# Altium project inter.PrjPcb
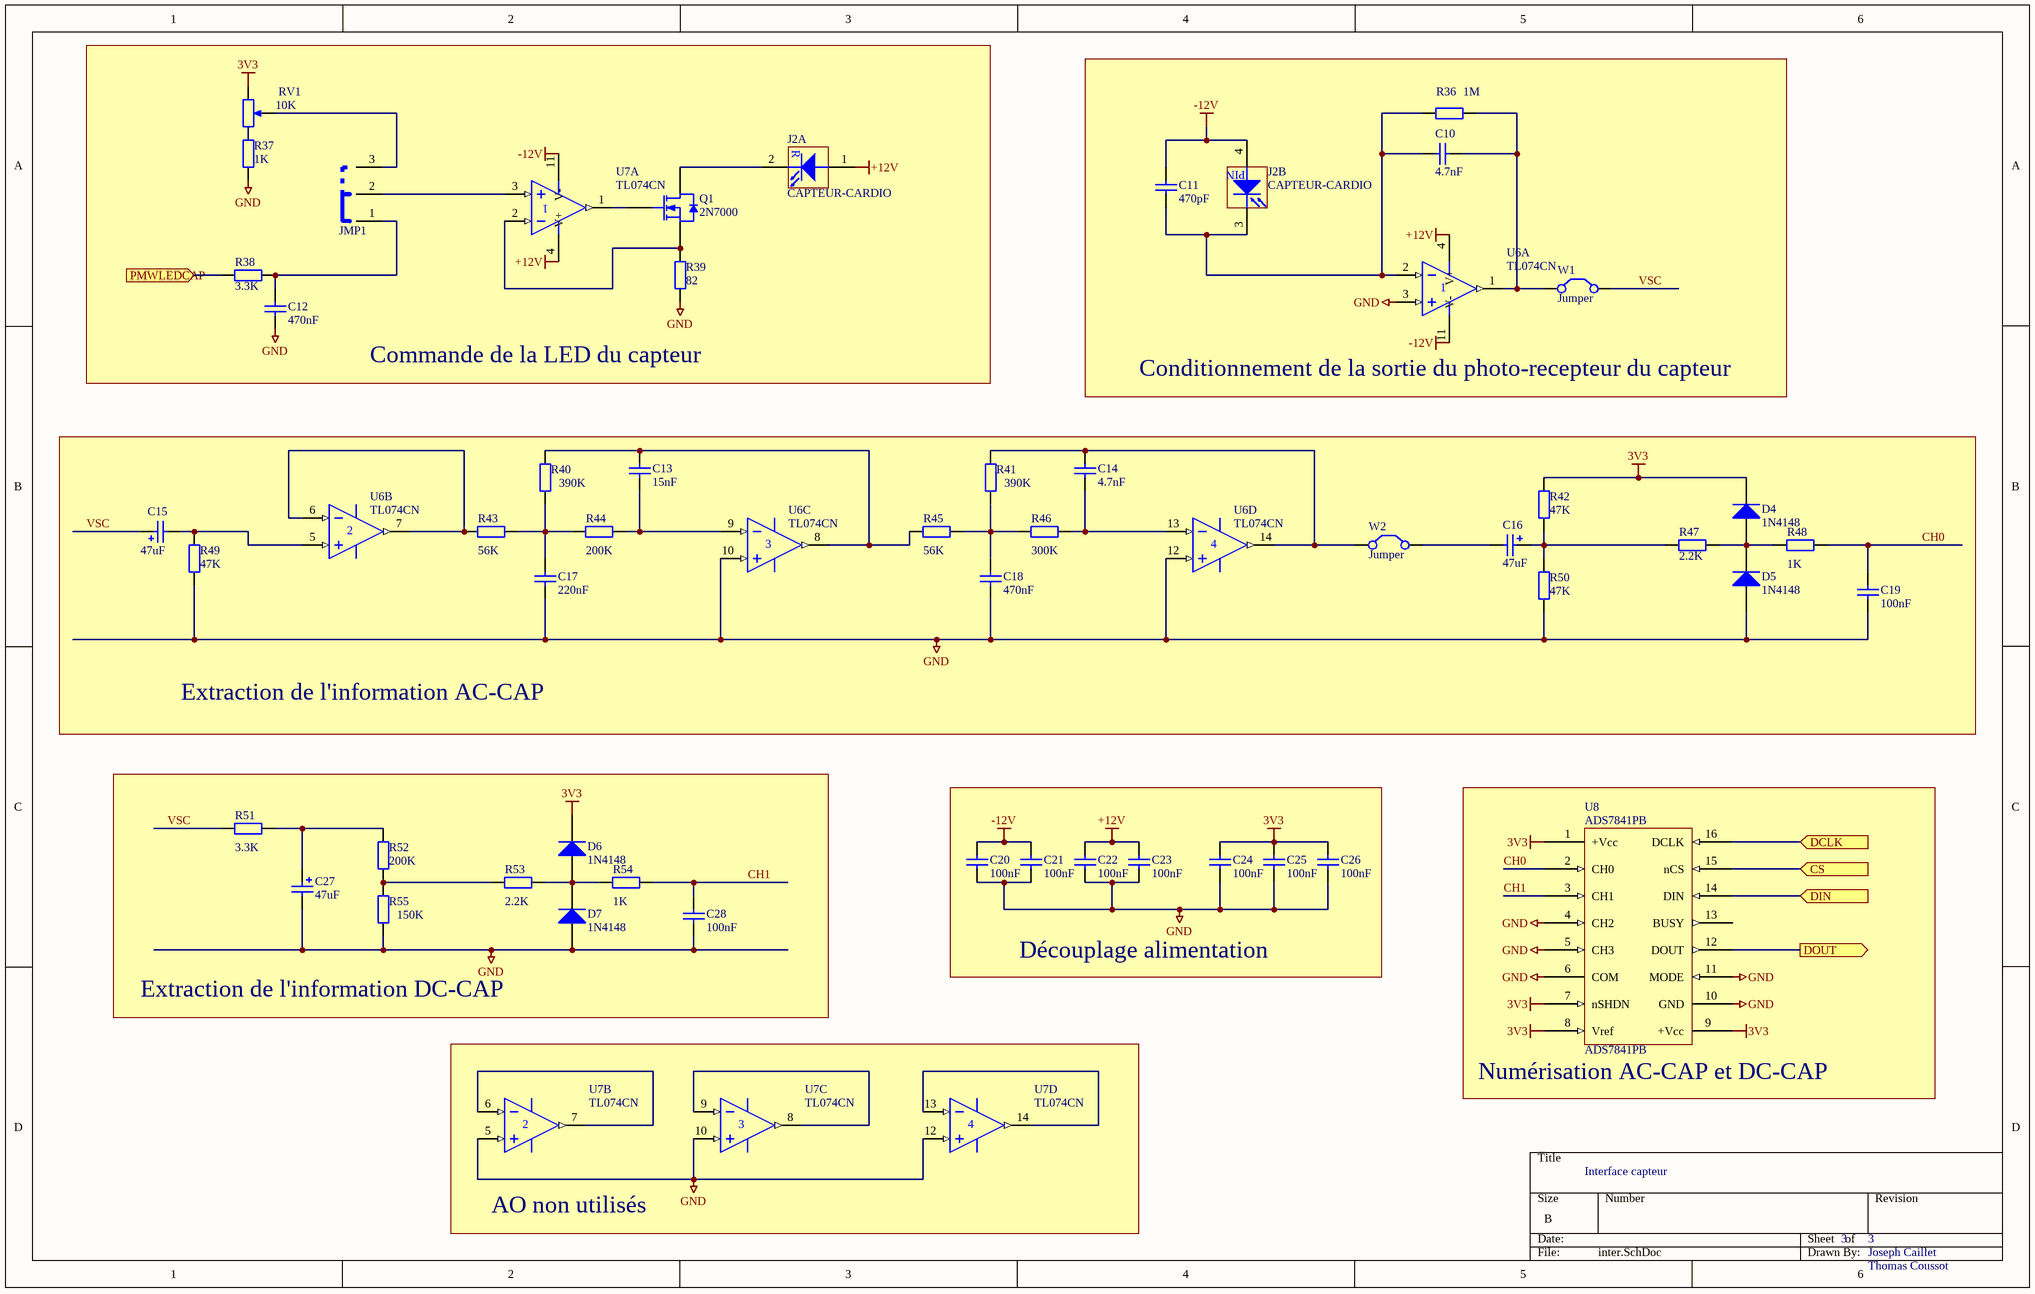
[diagram p0: inter.SchDoc]
1 sheet, 52 parts. Net scope: flat (ports and power ports of the same name join across sheets).

## Sheet inter.SchDoc
size B

### Parts
C10  4.7nF  [rad-0.2-bot]
C11  470pF  [rad-0.2-bot]
C12  470nF  [rad-0.2-bot]
C13  15nF  [rad-0.2-bot]
C14  4.7nF  [rad-0.2-bot]
C15  47uF  [RAD-0.2-BOT]
C16  47uF  [RAD-0.2-BOT]
C17  220nF  [rad-0.2-bot]
C18  470nF  [rad-0.2-bot]
C19  100nF  [rad-0.2]
C20  100nF  [rad-0.2]
C21  100nF  [rad-0.2]
C22  100nF  [rad-0.2]
C23  100nF  [rad-0.2]
C24  100nF  [rad-0.2]
C25  100nF  [rad-0.2]
C26  100nF  [rad-0.2]
C27  47uF  [RAD-0.2-BOT]
C28  100nF  [rad-0.2]
D4  1N4148  [diode-0.4]
D5  1N4148  [diode-0.4]
D6  1N4148  [diode-0.4]
D7  1N4148  [diode-0.4]
J2  CAPTEUR-CARDIO  [KK-1X4M]  (parts A,B of 2)
JMP1  JUMPER-INV  [JMP3-INV-0.1]  (value not drawn)
Q1  2N7000  [NMOS-TO92]
R36  1M  [axial-0.4]
R37  1K  [axial-0.4]
R38  3.3K  [axial-0.4]
R39  82  [axial-0.4]
R40  390K  [axial-0.4]
R41  390K  [axial-0.4]
R42  47K  [axial-0.4]
R43  56K  [axial-0.4]
R44  200K  [axial-0.4]
R45  56K  [axial-0.4]
R46  300K  [axial-0.4]
R47  2.2K  [axial-0.4]
R48  1K  [axial-0.4]
R49  47K  [axial-0.4]
R50  47K  [axial-0.4]
R51  3.3K  [axial-0.4]
R52  200K  [axial-0.4]
R53  2.2K  [axial-0.4]
R54  1K  [axial-0.4]
R55  150K  [axial-0.4]
RV1  10K  [VR-3386F-T]
U6  TL074CN  [dip-14]  (parts A,B,C,D of 4)
U7  TL074CN  [dip-14]  (parts A,B,C,D of 4)
U8  ADS7841PB  [DIP-16]
W1  Jumper  [JMP2-0.1]
W2  Jumper  [JMP2-0.1]

### Blocks framed on the sheet
Commande de la LED du capteur: C12 J2 JMP1 Q1 R37-R39 RV1 U7
Conditionnement de la sortie du photo-recepteur du capteur: C10 C11 J2 R36 U6 W1
Extraction de l'information AC-CAP: C13-C19 D4 D5 R40-R50 U6 W2
Extraction de l'information DC-CAP: C27 C28 D6 D7 R51-R55
Découplage alimentation: C20-C26
Numérisation AC-CAP et DC-CAP: U8
AO non utilisés: U7

### Ports
CS (in), DCLK (in), DIN (in), DOUT (out), PMWLEDCAP (in)

### Nets
3V3: C24.2 C25.2 C26.2 D4.2(K) D6.2(K) R42.2 RV1.2(BOT) U8.1(+Vcc) U8.7(nSHDN) U8.8(Vref) U8.9(+Vcc)
+12V: C22.2 C23.2 J2.1(A-R) U6.4(V+) U7.4(V+)
-12V: C11.2 C20.2 C21.2 J2.4(A-DET) U6.11(V-) U7.11(V-)
GND: C12.1 C17.2 C18.2 C19.1 C20.1 C21.1 C22.1 C23.1 C24.1 C25.1 C26.1 C27.2 C28.1 D5.1(A) D7.1(A) R37.1 R39.2 R49.1 R50.1 R55.2 U6.3(IN+) U6.10(IN+) U6.12(IN+) U7.5(IN+) U7.10(IN+) U7.12(IN+) U8.4(CH2) U8.5(CH3) U8.6(COM) U8.10(GND) U8.11(MODE)
CH0: C19.2 R48.1 U8.2(CH0)
CH1: C28.2 R54.1 U8.3(CH1)
VSC: C15.1 R51.2 W1.2(C2)
NetC10_1: C10.1 R36.2 U6.1(OUT) W1.1(C1)
NetC10_2: C10.2 C11.1 J2.3(K-DET) R36.1 U6.2(IN-)
NetC12_2: C12.2 JMP1.1 R38.2
NetC13_1: C13.1 R40.2 R45.2 U6.8(OUT)
NetC13_2: C13.2 R44.2 U6.9(IN-)
NetC14_1: C14.1 R41.2 U6.14(OUT) W2.1(C1)
NetC14_2: C14.2 R46.2 U6.13(IN-)
NetC15_2: C15.2 R49.2 U6.5(IN+)
NetC16_1: C16.1 R42.1 R47.2 R50.2
NetC16_2: C16.2 W2.2(C2)
NetC17_1: C17.1 R40.1 R43.1 R44.1
NetC18_1: C18.1 R41.1 R45.1 R46.1
NetC27_1: C27.1 R51.1 R52.1
NetD4_1: D4.1(A) D5.2(K) R47.1 R48.2
NetD6_1: D6.1(A) D7.2(K) R53.1 R54.2
NetJ2_2: J2.2(K-R) Q1.1(D)
NetJMP1_2: JMP1.2 U7.3(IN+)
NetJMP1_3: JMP1.3 RV1.3(TAP)
NetQ1_2: Q1.2(G) U7.1(OUT)
NetQ1_3: Q1.3(S) R39.1 U7.2(IN-)
NetR37_2: R37.2 RV1.1(TOP)
NetR38_1: R38.1 ; port PMWLEDCAP
NetR43_2: R43.2 U6.6(IN-) U6.7(OUT)
NetR52_2: R52.2 R53.2 R55.1
NetU7_6: U7.6(IN-) U7.7(OUT)
NetU7_8: U7.8(OUT) U7.9(IN-)
NetU7_13: U7.13(IN-) U7.14(OUT)
NetU8_12: U8.12(DOUT) ; port DOUT
NetU8_14: U8.14(DIN) ; port DIN
NetU8_15: U8.15(nCS) ; port CS
NetU8_16: U8.16(DCLK) ; port DCLK

Not connected (* = marked no-connect by the designer): U8 13(BUSY)

### Notes on the sheet
- Interface capteur
- 3
- Joseph Caillet
- Thomas Coussot
- (in symbol CAPTEUR-CARDIO, part A) R
- (in symbol CAPTEUR-CARDIO, part B) PIN

### Library data of the parts
C10-C14 C17 C18 = Cap: Capacitor Polyester 5%; Published: 8-Jun-2000; LatestRevisionDate: 17-Jul-2002; LatestRevisionNote: Re-released for DXP Platform.; PackageReference: RAD-0.3; Publisher: Altium Limited; PackageDescription: Radial Cap, Thru-Hole; 2 Leads; 0.3 in Pin Spacing
  C10 C14: Value: 4.7nF
  C11: Value: 470pF
  C12 C18: Value: 470nF
  C13: Value: 15nF
  C17: Value: 220nF
C15 C16 C27 = Cap Pol1: Polarized Capacitor (Axial); Published: 8-Jun-2000; LatestRevisionDate: 17-Jul-2002; LatestRevisionNote: Re-released for DXP Platform.; PackageReference: RB7.6-15; Publisher: Altium Limited; PackageDescription: Polarized Capacitor (Radial); 2 Leads; Value: 47uF
C19-C26 C28 = Cap: Capacitor Céramique Multicouche X7R 50V RadialPas=5.08mm 50%; Published: 8-Jun-2000; LatestRevisionDate: 17-Jul-2002; LatestRevisionNote: Re-released for DXP Platform.; PackageReference: RAD-0.3; Publisher: Altium Limited; PackageDescription: Radial Cap, Thru-Hole; 2 Leads; 0.3 in Pin Spacing; Value: 100nF
D4-D7 = 1N4148: High Conductance Fast Diode; Published: 8-Jun-2000; LatestRevisionDate: 17-Jul-2002; LatestRevisionNote: Re-released for DXP Platform.; DatasheetDocument: 1997; PackageReference: DO-35; Publisher: Altium Limited; Code_JEDEC: DO-204-AH; ComponentLink1Description: Manufacturer Link; ComponentLink1URL: http://www.fairchildsemi.com/; ComponentLink2Description: Datasheet; ComponentLink2URL: http://www.fairchildsemi.com/ds/1N%2F1N4148.pdf
J2 = CAPTEUR-CARDIO: CAPTEUR CARDIO
JMP1 = JUMPER-INV: JUMPER INVERSEUR HE14 MALE 3 cts
Q1 = 2N7000: N-channel Enhancement Mode Field-effect Transistor; Published: 17-Sep-2003; LatestRevisionDate: 12-Dec-2006; LatestRevisionNote: Footprint pad sequence fixed.; DatasheetVersion: 19-May-2000; PackageVersion: Feb-1997; PackageReference: SOT54; Publisher: Altium Limited; PackageDescription: Plastic Single-Ended Leaded (through hole) package; 3 Leads (TO-92); Code_JEITA: SC-43; Code_JEDEC: TO-92; ComponentLink1Description: Manufacturer Link; ComponentLink1URL: http://www.semiconductors.philips.com/; ComponentLink2Description: Datasheet; ComponentLink2URL: http://www.semiconductors.philips.com/acrobat/datasheets/2N7000-03.pdf
R36 R40-R47 R49-R51 = Res2: Resistor 1% Couche métallique 0.4W Axial L=7mm; Published: 8-Jun-2000; LatestRevisionDate: 17-Jul-2002; LatestRevisionNote: Re-released for DXP Platform.; PackageReference: AXIAL-0.4; Publisher: Altium Limited; PackageDescription: Axial Device, Thru-Hole; 2 Leads; 0.4 in Pin Spacing
  R36: Value: 1M
  R40 R41: Value: 390K
  R42 R49 R50: Value: 47K
  R43 R45: Value: 56K
  R44: Value: 200K
  R46: Value: 300K
  R47: Value: 2.2K
  R51: Value: 3.3K
R37-R39 R48 R52-R55 = Res2: Resistor 5% Couche métallique 0.4W Axial L=7mm; Published: 8-Jun-2000; LatestRevisionDate: 17-Jul-2002; LatestRevisionNote: Re-released for DXP Platform.; PackageReference: AXIAL-0.4; Publisher: Altium Limited; PackageDescription: Axial Device, Thru-Hole; 2 Leads; 0.4 in Pin Spacing
  R37 R48 R54: Value: 1K
  R38: Value: 3.3K
  R39: Value: 82
  R52: Value: 200K
  R53: Value: 2.2K
  R55: Value: 150K
RV1 = R-TRIM: TRIMMER PRECISION POTENTIOMETER; Manufacturer: Bourns/Vishay; Class I: Passive; Set Position: 0.5; Class II: Potentiometer; Value: 10K
U6 U7 = TL074CN: Low-Noise JFET-Input Operational Amplifier; Manufacturer: Texas/Motorola; Published: 17-Jul-2002; LatestRevisionDate: 06-Jun-2005; LatestRevisionNote: Stylized 3D Model Added.; DatasheetVersion: 1988; PackageVersion: 1997; PackageReference: 646-06; Publisher: Altium Limited; PackageDescription: DIP; 14 Leads; Row Spacing 7.62 mm; Pitch 2.54 mm; ComponentLink1Description: Manufacturer Link; ComponentLink1URL: http://www.onsemi.com/site/products/parametrics/0,4446,251,00.html
U8 = ADS7841PB: Analog to Digital converter; Manufacturer: TEXAS
W1 W2 = Jumper: Jumper Wire; Published: 24-Mar-1999; LatestRevisionDate: 17-Jul-2002; LatestRevisionNote: Re-released for DXP Platform.; PackageReference: RAD-0.2; Publisher: Altium Limited; PackageDescription: Radial Cap, Thru-Hole; 2 Leads; 0.2 in Pin Spacing